# Altium schematic sheet Sheet2.SchDoc
size A4
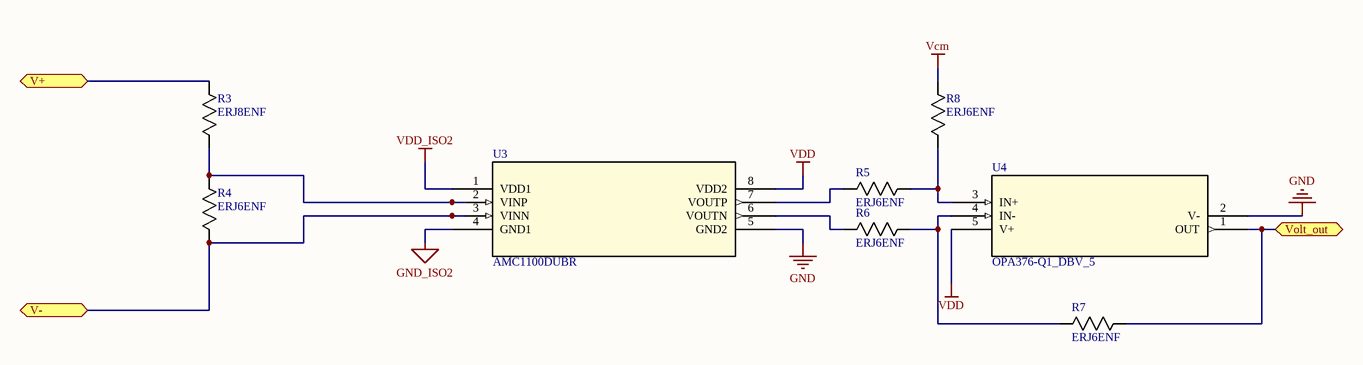
[diagram p0: Sheet2.SchDoc]

## Parts
R3  ERJ8ENF  [1206]
R4  ERJ6ENF  [0805]
R5  ERJ6ENF  [0805]
R6  ERJ6ENF  [0805]
R7  ERJ6ENF  [0805]
R8  ERJ6ENF  [0805]
U3  AMC1100DUBR  [DUB8]
U4  OPA376-Q1_DBV_5  [DBV5]

## Ports
V+ (bidir), V- (bidir), Volt_out (bidir)

## Nets
GND: U3.5(GND2) U4.2(V-)
GND_ISO2: U3.4(GND1)
Vcm: R8.2
VDD: U3.8(VDD2) U4.5(V+)
VDD_ISO2: U3.1(VDD1)
V+: R3.2 ; port V+
V-: R4.1 U3.3(VINN) ; port V-
Volt_out: R7.2 U4.1(OUT) ; port Volt_out
NetR3_1: R3.1 R4.2 U3.2(VINP)
NetR5_1: R5.1 U3.7(VOUTP)
NetR5_2: R5.2 R8.1 U4.3(IN+)
NetR6_1: R6.1 U3.6(VOUTN)
NetR6_2: R6.2 R7.1 U4.4(IN-)

## Library data of the parts
R3 = ERJ8ENF: Imported; Manufacturer_Part_Number: ERJ8ENF1000V; Vendor: Panasonic; Built_By: EMA_UL_Team; C: Copyright (C) 2016 Accelerated Designs. All rights reserved; RefDes: RefDes; Type: DEV; Value: Value
R4-R8 = ERJ6ENF: Imported; Manufacturer_Part_Number: ERJ6ENF1000V; Vendor: Panasonic; Built_By: EMA_UL_Team; C: Copyright (C) 2016 Accelerated Designs. All rights reserved; RefDes: RefDes; Type: DEV; Value: Value
U3 = AMC1100DUBR: Imported; Vendor: Texas Instruments; Built_By: EMA_UL_Team; C: Copyright (C) 2015 Accelerated Designs. All rights reserved; Manufacturer_Part_Number: AMC1100DUBR; RefDes: RefDes; Type: DEV; Value: Value
U4 = OPA376-Q1_DBV_5: Imported; Manufacturer: Texas Instruments; Built_By: EMA_UL_Team; C: Copyright (C) 2015 Accelerated Designs. All rights reserved; Vendor: Texas Instruments; Manufacturer_Part_Number: OPA376-Q1_DBV_5; RefDes: RefDes; Type: DEV; Value: Value